# EAGLE design digital_board (EAGLE 7.6.0)
CNAME: 3Dator Extensionboard (C) 3Dator GmbH; CREVISION: 0.6; DESIGNER: 3Dator GmbH
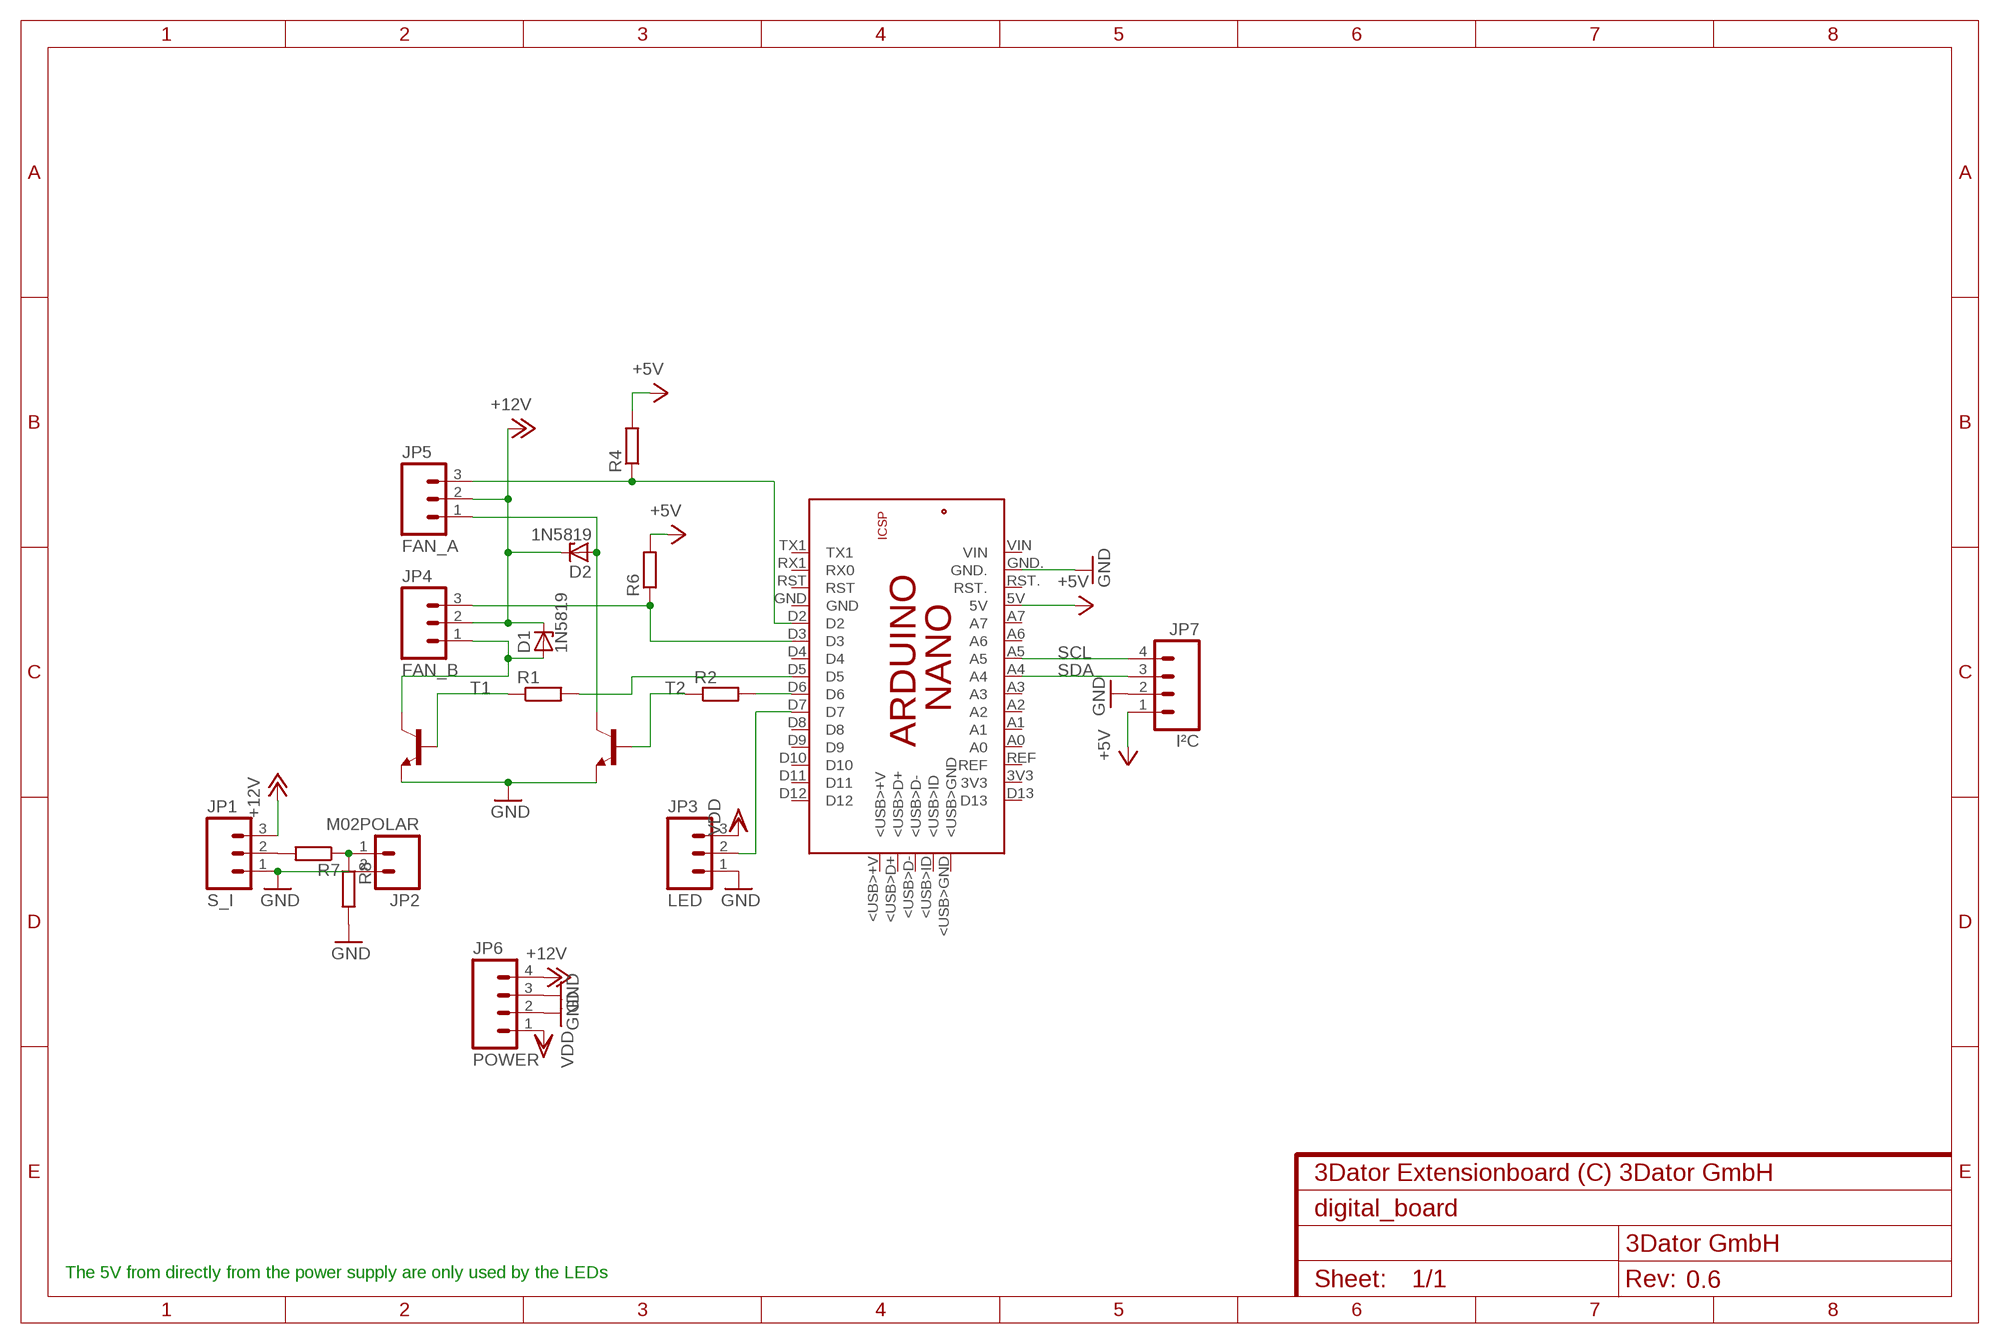
[diagram p0: schematic, sheet 1]

## Parts
D1  1N5819  1N821  [DO35Z10]
D2  1N5819  1N821  [DO35Z10]
JP1  S_I  M03POLAR  [MOLEX-1X3]
JP2  M02POLAR  [MOLEX-1X2]
JP3  LED  M03POLAR  [MOLEX-1X3]
JP4  FAN_B  M03POLAR  [MOLEX-1X3]
JP5  FAN_A  M03POLAR  [MOLEX-1X3]
JP6  POWER  M04POLAR  [MOLEX-1X4]
JP7  I²C  M04POLAR  [MOLEX-1X4]
PCB2  ARDUINO_NANO  [ARDUINO_NANO]
R1  R-EU_0309/10  [0309/10]
R2  R-EU_0309/10  [0309/10]
R4  R-EU_0309/10  [0309/10]
R6  R-EU_0309/10  [0309/10]
R7  R-EU_0309/10  [0309/10]
R8  R-EU_0309/10  [0309/10]
T1  BC548-NPN-TO92-CBE  [TO92-CBE]
T2  BC548-NPN-TO92-CBE  [TO92-CBE]

## Nets
+5V: JP7.1 PCB2.5V R4.2 R6.2
+12V: D1.C D2.C JP1.3 JP4.2 JP5.2 JP6.4
GND: JP1.1 JP2.2 JP3.1 JP6.2 JP6.3 JP7.2 PCB2.GND. R8.2 T1.E T2.E
N$2: R2.1
N$3: D1.A JP4.1 T1.C
N$4: D2.A JP5.1 T2.C
N$5: R1.1 T1.B
N$7: PCB2.D5 R1.2
N$8: PCB2.D6 R2.2
N$12: JP4.3 PCB2.D3 R6.1
N$13: JP5.3 PCB2.D2 R4.1
N$14: JP1.2 R7.2
N$15: JP2.1 R7.1 R8.1
N$16: JP3.2 PCB2.D7
SCL: JP7.4 PCB2.A5
SDA: JP7.3 PCB2.A4
VDD: JP3.3 JP6.1
Unconnected: PCB2.3V3 PCB2.5V. PCB2.<USB>+V PCB2.<USB>D+ PCB2.<USB>D- PCB2.<USB>GND PCB2.<USB>ID PCB2.A0 PCB2.A1 PCB2.A2 PCB2.A3 PCB2.A6 PCB2.A7 PCB2.D4 PCB2.D8 PCB2.D9 PCB2.D10 PCB2.D11 PCB2.D12 PCB2.D13 PCB2.GND PCB2.GND_ PCB2.MISO PCB2.MOSI PCB2.REF PCB2.RESET.. PCB2.RST PCB2.RST. PCB2.RX1(RX0) PCB2.SCK PCB2.TX1 PCB2.VIN T2.B

## Notes on the sheet
- The 5V from directly from the power supply are only used by the LEDs

## Library data of the parts
D1 D2 = diode:1N821: Reference DIODE temperature compensated, 6,2 V
JP1 JP3-JP5 = SparkFun-Connectors:M03: Header 3 Standard 3-pin 0.1" header. Use with straight break away headers (SKU : PRT-00116), right angle break away headers (PRT-00553), swiss pins (PRT-00743), machine pins (PRT-00117), and female headers (PRT-00115). Molex polarized connector foot print use with SKU : PRT-08232 with associated crimp pins and housings.
JP2 = SparkFun-Connectors:M02: Standard 2-pin 0.1" header. Use with - straight break away headers ( PRT-00116) - right angle break away headers (PRT-00553) - swiss pins (PRT-00743) - machine pins (PRT-00117) - female headers (PRT-00115) Molex polarized connector foot print use with: PRT-08233 with associated crimp pins and housings. 2.54_SCREWTERM for use with PRT-10571. 3.5mm Screw Terminal footprints for PRT-08084 5mm Screw Terminal footprints for use with PRT-08432
JP6 JP7 = SparkFun-Connectors:M04: Header 4 Standard 4-pin 0.1" header. Use with straight break away headers (SKU : PRT-00116), right angle break away headers (PRT-00553), swiss pins (PRT-00743), machine pins (PRT-00117), and female headers (PRT-00115). Molex polarized connector foot print use with SKU : PRT-08231 with associated crimp pins and housings. 1MM SMD Version SKU: PRT-10208
PCB2 = E14_Arduino_revB:ARDUINO_NANO: Device for representing an Arduino Nano board with a footprint in an EAGLE design. Created by Dave Young for Element14. More EAGLE documentation at: http://www.element14.com/community/community/knode/cadsoft_eagle
R1 R2 R4 R6-R8 = rcl:R-EU_: RESISTOR, European symbol
T1 T2 = transistor:*-NPN-: NPN Transistror BF959 corrected 2008.03.06

## Net classes
0 default: clearance 0.205 mm

## Board
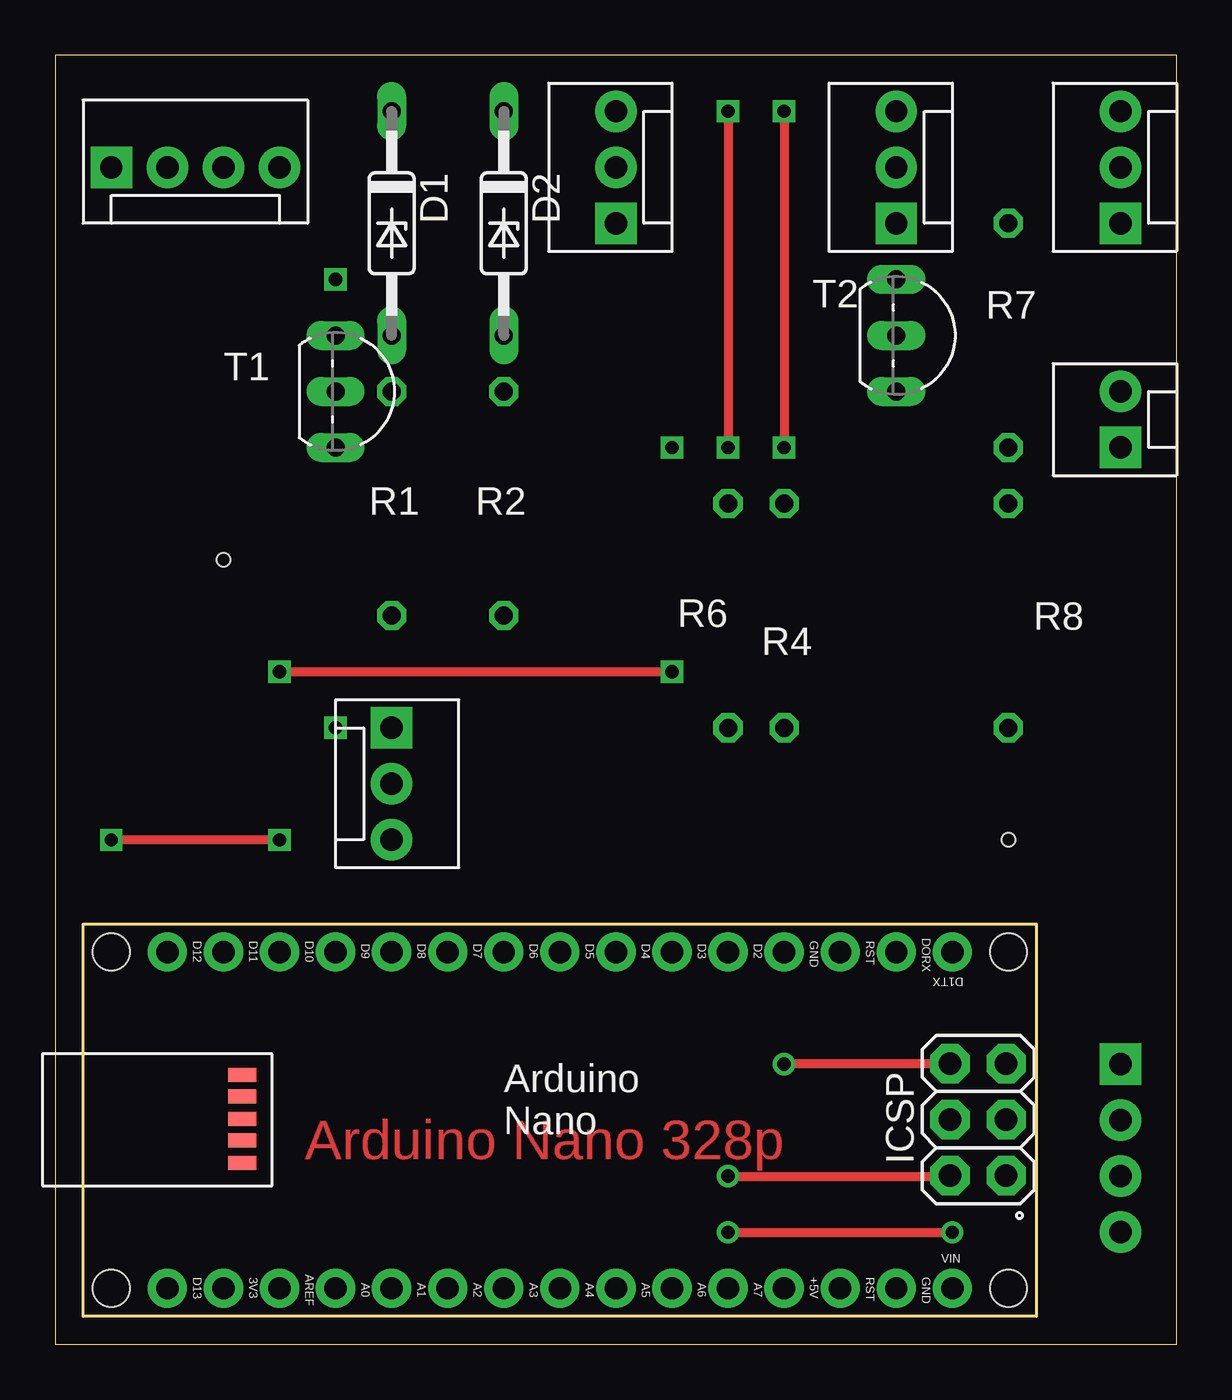
[diagram p1: board, top side]
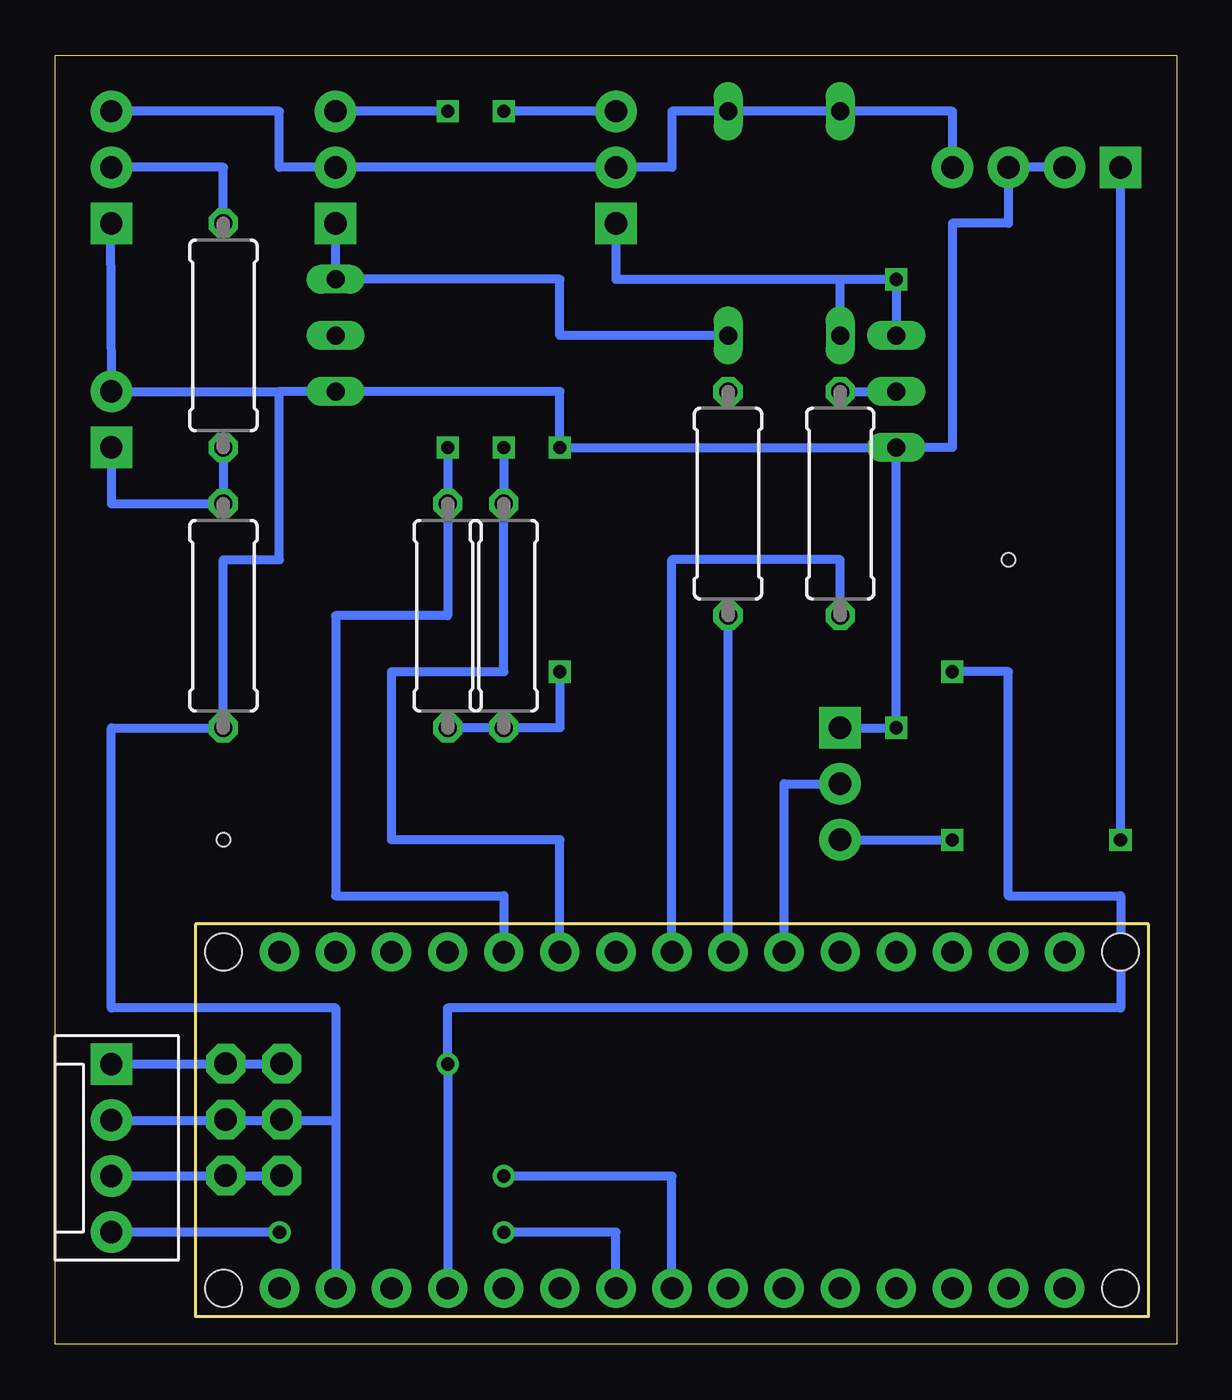
[diagram p2: board, bottom side, seen from below]

Size 50.8 x 58.42 mm. Coordinates in mm from the lower left corner, seen from the top.
Outline: 0,0 50.8,0 50.8,58.42 0,58.42 0,0
Copper layers (1*16): Top 0.035mm / dielectric 1.5mm / Bottom 0.035mm
Design rules "default": minimum track width 10mil, minimum drill 24mil, track to track 8mil, track to pad 8mil, pad to pad 8mil, via to via 8mil, smd to smd 8mil, copper to edge 40mil, drill to drill 8mil, minimum pad ring 10mil, minimum via ring 8mil, stop-mask expansion 4mil, vias tented up to drill 0mil, thermal gap 10mil
Holes 0.6 mm at 43.18,22.86 7.62,35.56

### Footprints (pad centres in the part's own frame; a part is rotated, then mirrored left to right if it is on the bottom)
DO35Z10 = drill 0.813 long: A 5.08,0; C -5.08,0
MOLEX-1X3 = drill 1.016 pad 1.88 square: 1 0,0 | drill 1.016 pad 1.88: 2 2.54,0; 3 5.08,0
MOLEX-1X2 = drill 1.016 pad 1.88 square: 1 0,0 | drill 1.016 pad 1.88: 2 2.54,0
MOLEX-1X4 = drill 1.016 pad 1.88 square: 1 0,0 | drill 1.016 pad 1.88: 2 2.54,0; 3 5.08,0; 4 7.62,0
ARDUINO_NANO = drill 1.016 pad 1.778: 3V3 6.35,1.27; 5V 31.75,1.27; A0 11.43,1.27; A1 13.97,1.27; A2 16.51,1.27; A3 19.05,1.27; A4 21.59,1.27; A5 24.13,1.27; A6 26.67,1.27; A7 29.21,1.27; D2 29.21,16.51; D3 26.67,16.51; D4 24.13,16.51; D5 21.59,16.51; D6 19.05,16.51; D7 16.51,16.51; D8 13.97,16.51; D9 11.43,16.51; D10 8.89,16.51; D11 6.35,16.51; D12 3.81,16.51; D13 3.81,1.27; GND 31.75,16.51; GND. 36.83,1.27; REF 8.89,1.27; RST 34.29,16.51; RST. 34.29,1.27; RX1 36.83,16.51; TX1 39.37,16.51; VIN 39.37,1.27 | drill 1.016 pad 1.778 octagon: 5V. 39.268,6.375; GND_ 39.268,11.455; MISO 41.808,6.375; MOSI 39.268,8.915; RESET.. 41.808,11.455; SCK 41.808,8.915 | smd 1.27 x 0.635: <USB>+V 7.214,10.947; <USB>D+ 7.214,9.957; <USB>D- 7.214,8.941; <USB>GND 7.214,6.96; <USB>ID 7.214,7.976 | hole 1.651: 1.27,1.27; 1.27,16.51; 41.91,16.51; 41.91,1.27
0309/10 = drill 0.813 octagon: 1 -5.08,0; 2 5.08,0
TO92-CBE = drill 0.813 long: B 0,0; C -2.54,0; E 2.54,0

### Placement (x,y rotation side)
D1  15.24,50.8 270 top
D2  20.32,50.8 270 top
JP1  48.26,50.8 90 top
JP2  48.26,40.64 90 top
JP3  15.24,27.94 270 top
JP4  25.4,50.8 90 top
JP5  38.1,50.8 90 top
JP6  2.54,53.34 0 top
JP7  48.26,12.7 270 bottom
PCB2  1.27,1.27 0 top
R1  15.24,38.1 270 bottom
R2  20.32,38.1 270 bottom
R4  33.02,33.02 270 bottom
R6  30.48,33.02 270 bottom
R7  43.18,45.72 90 bottom
R8  43.18,33.02 270 bottom
T1  12.7,43.18 270 top
T2  38.1,45.72 270 top

### Tracks (layer width: path | path; a pad name or v marks a point on that pad's centre or on a via)
+5V  (via drill 0.6)
  Top 0.406: v10.16,30.48 v27.94,30.48 | v40.64,12.7 v33.02,12.7
  Bottom 0.406: R4.2 R6.2 27.94,27.94 v27.94,30.48 | v10.16,30.48 7.62,30.48 7.62,20.32 2.54,20.32 2.54,15.24 33.02,15.24 v33.02,12.7 PCB2.5V | JP7.1 v40.64,12.7
+12V
  Bottom 0.406: JP1.3 40.64,55.88 40.64,53.34 JP5.2 JP4.2 22.86,53.34 22.86,55.88 D2.C D1.C 10.16,55.88 JP6.4
GND  (via drill 0.6)
  Bottom 0.406: T1.E v27.94,40.64 27.94,43.18 T2.E 40.64,43.18 | JP1.1 48.3,50.8 JP2.2 40.64,43.18 | 40.64,43.18 40.64,35.56 43.18,35.56 R8.2 48.26,27.94 48.26,15.24 38.1,15.24 38.1,10.16 | JP3.1 v12.7,27.94 T1.E | JP6.2 JP6.3 7.62,50.8 10.16,50.8 10.16,40.64 T1.E | 38.1,10.16 PCB2.GND. | JP7.2 38.1,10.16
N$3  (via drill 0.6)
  Bottom 0.406: JP4.1 25.4,48.26 15.24,48.26 | 15.24,48.26 v12.7,48.26 T1.C | D1.A 15.24,48.26
N$4
  Bottom 0.406: JP5.1 T2.C 27.94,48.26 27.94,45.72 D2.A
N$5
  Bottom 0.406: R1.1 T1.B
N$7
  Bottom 0.406: R1.2 15.24,35.56 22.86,35.56 PCB2.D5
N$8
  Bottom 0.406: PCB2.D6 R2.2
N$12  (via drill 0.6)
  Top 0.406: v30.48,55.88 v30.48,40.64
  Bottom 0.406: v30.48,40.64 R6.1 30.48,30.48 35.56,30.48 35.56,22.86 27.94,22.86 PCB2.D3 | JP4.3 v30.48,55.88
N$13  (via drill 0.6)
  Top 0.406: v33.02,55.88 v33.02,40.64
  Bottom 0.406: v33.02,40.64 R4.1 33.02,33.02 38.1,33.02 38.1,20.32 30.48,20.32 PCB2.D2 | v33.02,55.88 JP5.3
N$14
  Bottom 0.406: R7.2 43.18,53.34 JP1.2
N$15
  Bottom 0.406: R7.1 R8.1 48.26,38.1 JP2.1 48.26,40.66
N$16
  Bottom 0.406: PCB2.D7 17.78,25.4 JP3.2
SCL  (via drill 0.6)
  Top 0.406: v30.48,5.08 v40.64,5.08
  Bottom 0.406: PCB2.A5 25.4,5.08 v30.48,5.08 | v40.64,5.08 JP7.4
SDA  (via drill 0.6)
  Top 0.406: v30.48,7.62 v40.64,7.62
  Bottom 0.406: PCB2.A4 22.86,7.62 v30.48,7.62 | v40.64,7.62 JP7.3
VDD  (via drill 0.6)
  Top 0.406: v10.16,22.86 v2.54,22.86
  Bottom 0.406: JP3.3 v10.16,22.86 | v2.54,22.86 JP6.1

### Text on the board
Top: Arduino Nano 328p